# Altium project comunicador_alarma_v1.PrjPCB
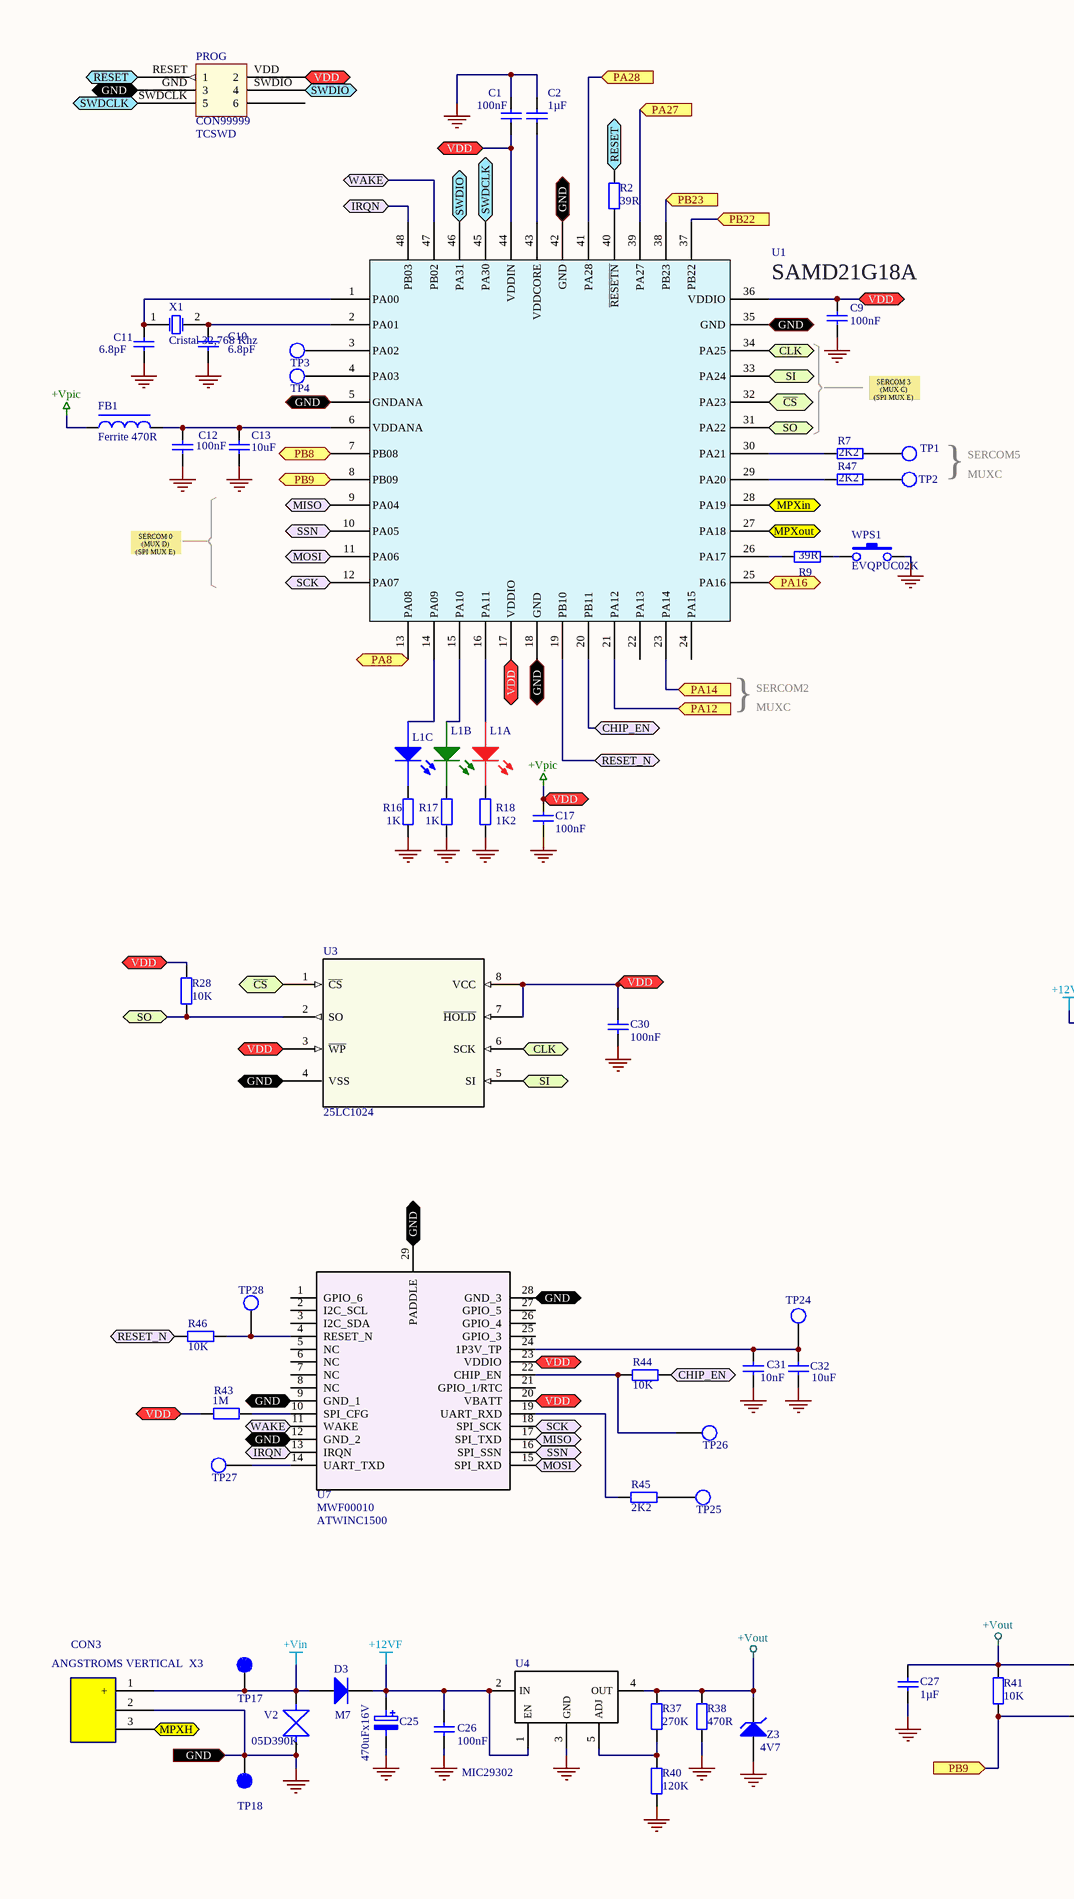
[diagram p0: comunicador_alarma_v1.SchDoc, left]
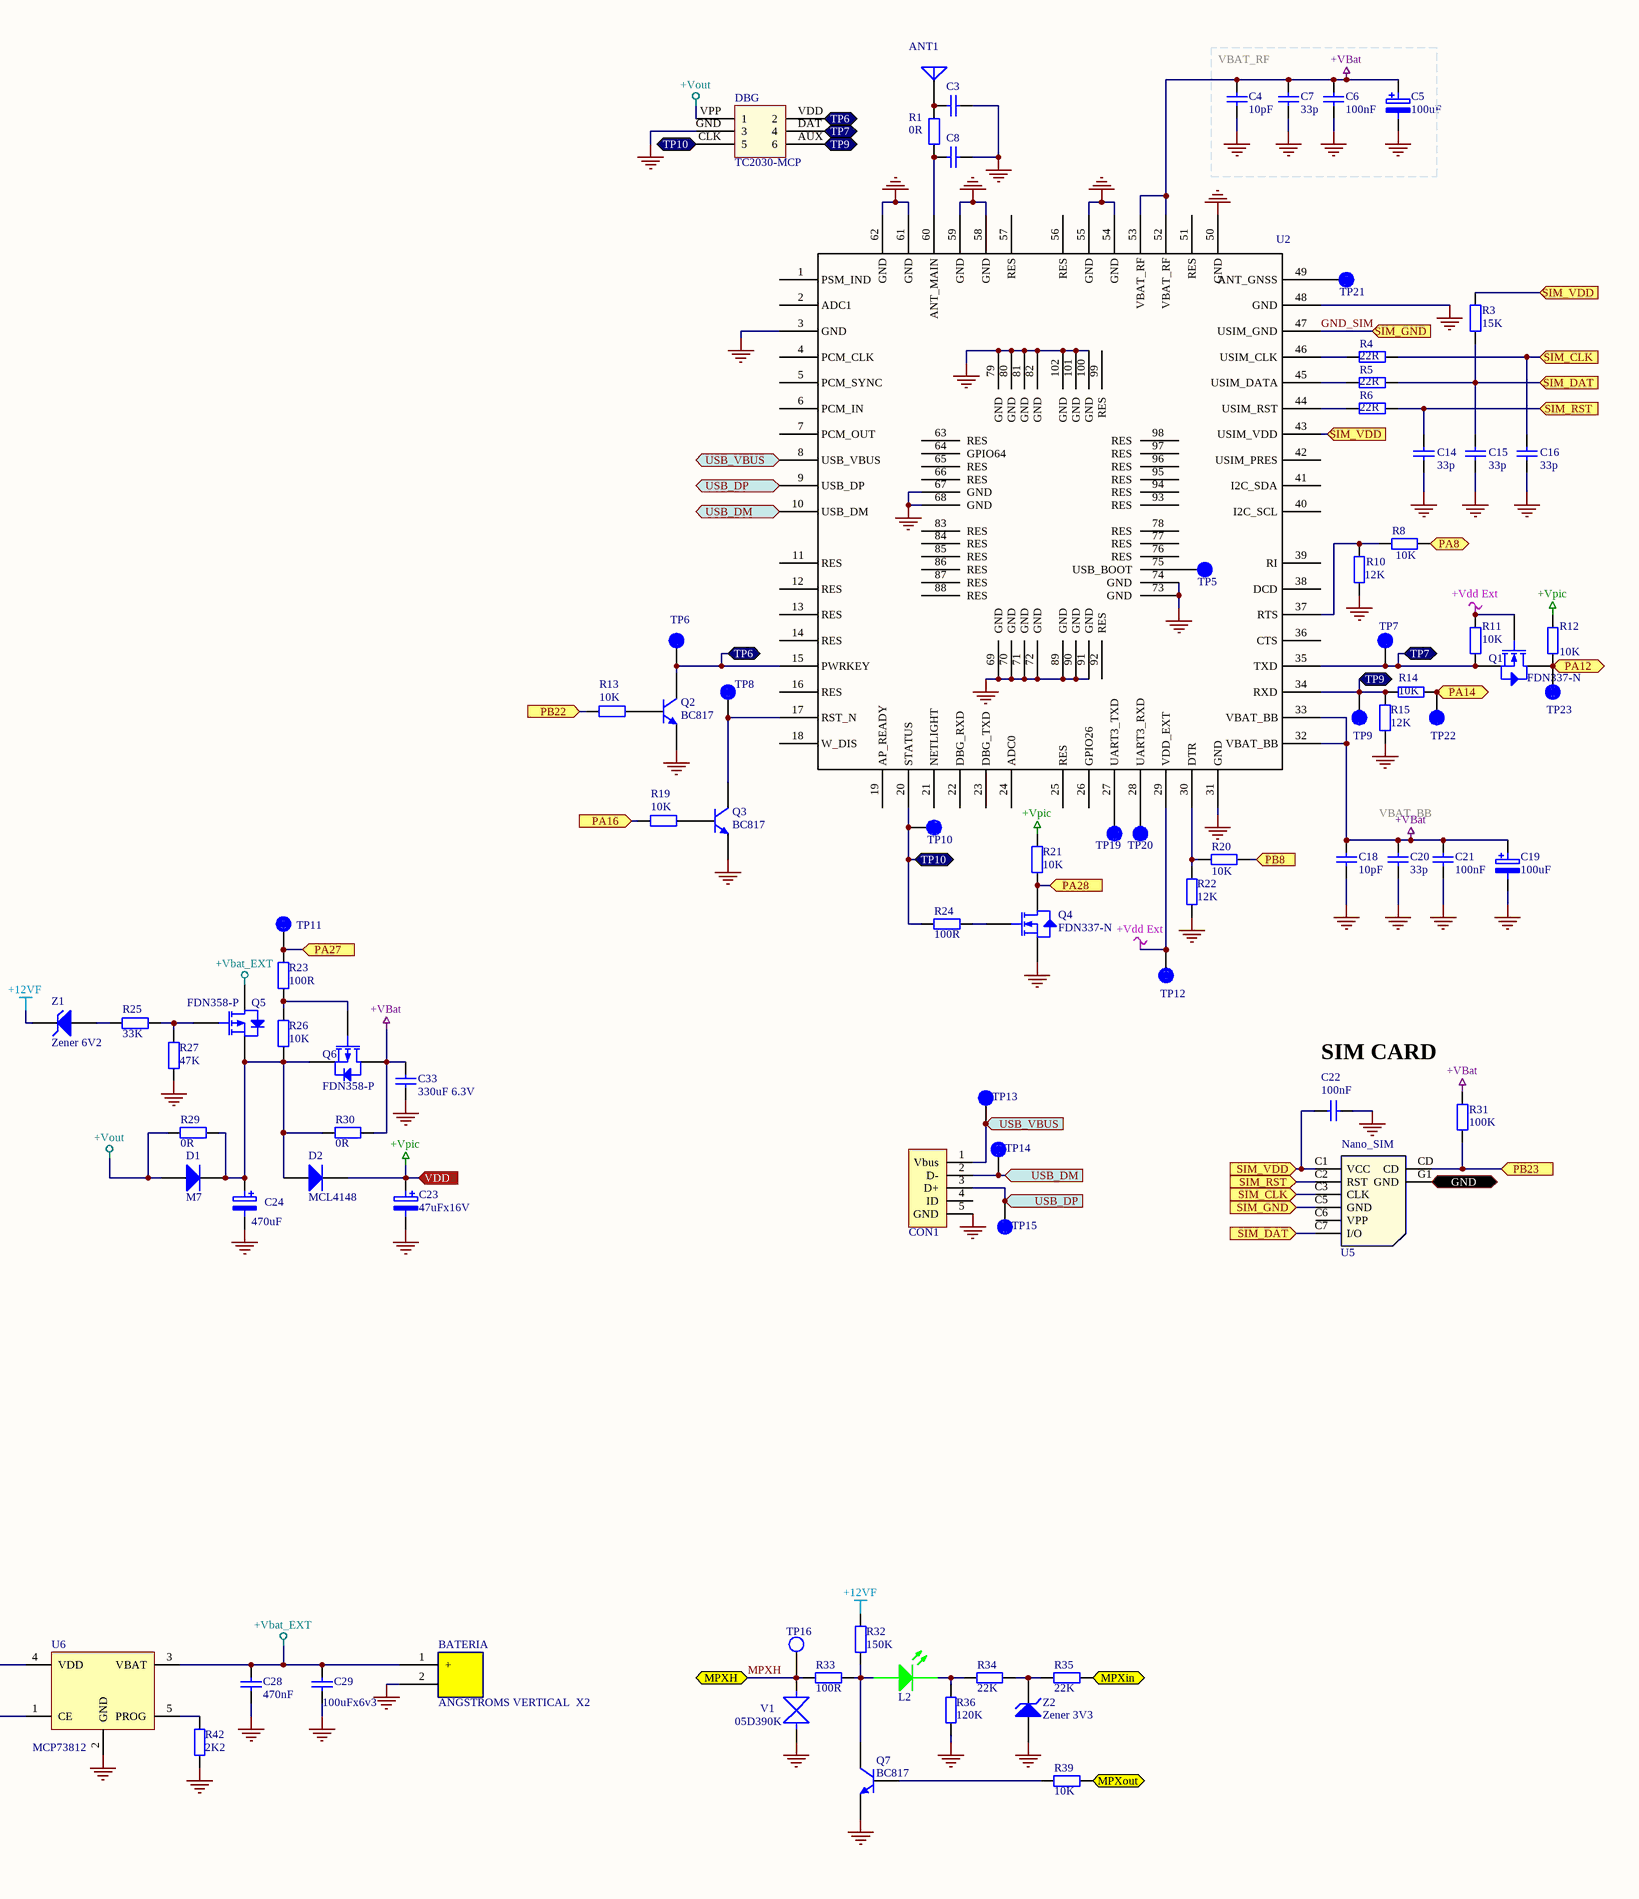
[diagram p1: comunicador_alarma_v1.SchDoc, right]
1 sheet, 141 parts. Net scope: flat (ports and power ports of the same name join across sheets).
Board file: comunicador_alarma_v1.PcbDoc

## Sheet comunicador_alarma_v1.SchDoc
size A2; DrawnBy: Mariano Mondani

### Parts
ANT1  CON01000  [CON.ANT]  (value not drawn)
BATERIA  value ANGSTROMS VERTICAL  X2  [CON.2V.SMD.ANGSTROMS]  (hidden comment: CON00590)
C1  value 100nF  [C.0805-rflow]  (hidden comment: CAX00450)
C2  value 1µF  [C.0805-rflow]  (hidden comment: CAX00500)
C3  (no value)  [C.0805-rflow]
C4  value 10pF  [C.0805-rflow]  (hidden comment: CAX00130)
C5  value 100uF  [CAP.TANT.3216-18]  (hidden comment: CTS00100)
C6  value 100nF  [C.0805-rflow]  (hidden comment: CAX00450)
C7  value 33p  [C.0805-rflow]  (hidden comment: CAX00180)
C8  (no value)  [C.0805-rflow]
C9  value 100nF  [C.0805-rflow]  (hidden comment: CAX00450)
C10  value 6.8pF  [C.0805-rflow]  (hidden comment: CAX00110)
C11  value 6.8pF  [C.0805-rflow]  (hidden comment: CAX00110)
C12  value 100nF  [C.0805-rflow]  (hidden comment: CAX00450)
C13  value 10uF  [C.212]  (hidden comment: CAX00520)
C14  value 33p  [C.0805-rflow]  (hidden comment: CAX00180)
C15  value 33p  [C.0805-rflow]  (hidden comment: CAX00180)
C16  value 33p  [C.0805-rflow]  (hidden comment: CAX00180)
C17  value 100nF  [C.0805-rflow]  (hidden comment: CAX00450)
C18  value 10pF  [C.0805-rflow]  (hidden comment: CAX00130)
C19  value 100uF  [CAP.TANT.3216-18]  (hidden comment: CTS00100)
C20  value 33p  [C.0805-rflow]  (hidden comment: CAX00180)
C21  value 100nF  [C.0805-rflow]  (hidden comment: CAX00450)
C22  value 100nF  [C.0805-rflow]  (hidden comment: CAX00450)
C23  value 47uFx16V  [CAP.CASE-C]  (hidden comment: CES00005)
C24  value 470uF  [CAP.CASE-E]  (hidden comment: CES00020)
C25  value 470uFx16V  [CAP.CASE-E]  (hidden comment: CES00020)
C26  value 100nF  [C.0805-rflow]  (hidden comment: CAX00450)
C27  value 1µF  [C.0805]  (hidden comment: CAX00500)
C28  value 470nF  [C.0805]  (hidden comment: CAX00460)
C29  value 100uFx6v3  [C.1206-rflow]  (hidden comment: CES00011)
C30  value 100nF  [C.0805-rflow]  (hidden comment: CAX00450)
C31  value 10nF  [C.0805-rflow]  (hidden comment: CAX00370)
C32  value 10uF  [C.212]  (hidden comment: CAX00520)
C33  value 330uF 6.3V  [C.1210]  (hidden comment: CAX00800)
CON1  USB MINI B Vert.  [USB.MINI.V]  (value not drawn)
CON3  value ANGSTROMS VERTICAL  X3  [CON.3V.SMD.ANGSTROMS]  (hidden comment: CON00600)
D1  value M7  [SMA.WAVE]  (hidden comment: DIS00030)
D2  value MCL4148  [MICROMELF-rflow]  (hidden comment: DIX00010)
D3  value M7  [SMA.RFLOW]  (hidden comment: DIS00030)
DBG  value TC2030-MCP  [TC.2030-IDC]  (hidden comment: CON99999)
FB1  value Ferrite 470R  [BOB.0603]  (hidden comment: FER00010)
L1  LES00150  [LED5050.RGB.FORYARD]  (value not drawn)  (parts A,B,C of 3)
L2  LES00090  [L.0805G]  (value not drawn)
PROG  value TCSWD  [TC_SWD]  (hidden comment: CON99999)
Q1  value FDN337-N  [SOT23-3]  (hidden comment: TRS00077)
Q2  value BC817  [SOT23-3]  (hidden comment: TRS00020)
Q3  value BC817  [SOT23-3]  (hidden comment: TRS00020)
Q4  value FDN337-N  [SOT23-3]  (hidden comment: TRS00077)
Q5  value FDN358-P  [SOT23-3]  (hidden comment: TRS00080)
Q6  value FDN358-P  [SOT23-3]  (hidden comment: TRS00080)
Q7  value BC817  [SOT23-3]  (hidden comment: TRS00020)
R1  value 0R  [R.0805-rflow]  (hidden comment: RSX00010)
R2  value 39R  [R.0805-rflow]  (hidden comment: RSX00065)
R3  value 15K  [R.0805-rflow]  (hidden comment: RSX00290)
R4  value 22R  [R.0805-rflow]  (hidden comment: RSX00050)
R5  value 22R  [R.0805-rflow]  (hidden comment: RSX00050)
R6  value 22R  [R.0805-rflow]  (hidden comment: RSX00050)
R7  value 2K2  [R.0805-rflow]  (hidden comment: RSX00200)
R8  value 10K  [R.0805-rflow]  (hidden comment: RSX00280)
R9  value 39R  [R.0805-rflow]  (hidden comment: RSX00065)
R10  value 12K  [R.0805-rflow]  (hidden comment: RSX00285)
R11  value 10K  [R.0805-rflow]  (hidden comment: RSX00280)
R12  value 10K  [R.0805-rflow]  (hidden comment: RSX00280)
R13  value 10K  [R.0805-rflow]  (hidden comment: RSX00280)
R14  value 10K  [R.0805-rflow]  (hidden comment: RSX00280)
R15  value 12K  [R.0805-rflow]  (hidden comment: RSX00285)
R16  value 1K  [R.0805-rflow]  (hidden comment: RSX00170)
R17  value 1K  [R.0805-rflow]  (hidden comment: RSX00170)
R18  value 1K2  [R.0805-rflow]  (hidden comment: RSX00180)
R19  value 10K  [R.0805-rflow]  (hidden comment: RSX00280)
R20  value 10K  [R.0805-rflow]  (hidden comment: RSX00280)
R21  value 10K  [R.0805-rflow]  (hidden comment: RSX00280)
R22  value 12K  [R.0805-rflow]  (hidden comment: RSX00285)
R23  value 100R  [R.0805-rflow]  (hidden comment: RSX00090)
R24  value 100R  [R.0805-rflow]  (hidden comment: RSX00090)
R25  value 33K  [R.0805-rflow]  (hidden comment: RSX00330)
R26  value 10K  [R.0805-rflow]  (hidden comment: RSX00280)
R27  value 47K  [R.0805-rflow]  (hidden comment: RSX00340)
R28  value 10K  [R.0805-rflow]  (hidden comment: RSX00280)
R29  value 0R  [R.0805-rflow]  (hidden comment: RSX00010)
R30  value 0R  [R.0805-rflow]  (hidden comment: RSX00010)
R31  value 100K  [R.0805-rflow]  (hidden comment: RSX00370)
R32  value 150K  [R.0805-rflow]  (hidden comment: RSX00390)
R33  value 100R  [R.0805-rflow]  (hidden comment: RSX00090)
R34  value 22K  [R.0805-rflow]  (hidden comment: RSX00310)
R35  value 22K  [R.0805-rflow]  (hidden comment: RSX00310)
R36  value 120K  [R.0805-rflow]  (hidden comment: RSX00380)
R37  value 270K  [R.0805-rflow]  (hidden comment: RSX00420)
R38  value 470R  [R.0805-rflow]  (hidden comment: RSX00140)
R39  value 10K  [R.0805-rflow]  (hidden comment: RSX00280)
R40  value 120K  [R.0805-rflow]  (hidden comment: RSX00380)
R41  value 10K  [R.0805-rflow]  (hidden comment: RSX00280)
R42  value 2K2  [R.0805-rflow]  (hidden comment: RSX00200)
R43  value 1M  [R.0805-rflow]  (hidden comment: RSX00490)
R44  value 10K  [R.0805-rflow]  (hidden comment: RSX00280)
R45  value 2K2  [R.0805-rflow]  (hidden comment: RSX00200)
R46  value 10K  [R.0805-rflow]  (hidden comment: RSX00280)
R47  value 2K2  [R.0805-rflow]  (hidden comment: RSX00200)
TP1  Test Point  [TestPoint_2mm]  (value not drawn)
TP2  Test Point  [TestPoint_2mm]  (value not drawn)
TP3  Test Point  [TestPoint_2mm]  (value not drawn)
TP4  Test Point  [TestPoint_2mm]  (value not drawn)
TP5  Test Point  [TestPoint_2mm]  (value not drawn)
TP6  Test Point  [TestPoint_2mm]  (value not drawn)
TP7  Test Point  [TestPoint_2mm]  (value not drawn)
TP8  Test Point  [TestPoint_2mm]  (value not drawn)
TP9  Test Point  [TestPoint_2mm]  (value not drawn)
TP10  Test Point  [TestPoint_2mm]  (value not drawn)
TP11  Test Point  [TestPoint_2mm]  (value not drawn)
TP12  Test Point  [TestPoint_2mm]  (value not drawn)
TP13  Test Point  [TestPoint_2mm]  (value not drawn)
TP14  Test Point  [TestPoint_2mm]  (value not drawn)
TP15  Test Point  [TestPoint_2mm]  (value not drawn)
TP16  Test Point  [TestPoint_2mm]  (value not drawn)
TP17  Test Point  [TestPoint_2mm]  (value not drawn)
TP18  Test Point  [TestPoint_2mm]  (value not drawn)
TP19  Test Point  [TestPoint_1mm]  (value not drawn)
TP20  Test Point  [TestPoint_1mm]  (value not drawn)
TP21  Test Point  [TestPoint_1mm]  (value not drawn)
TP22  Test Point  [TestPoint_2mm]  (value not drawn)
TP23  Test Point  [TestPoint_2mm]  (value not drawn)
TP24  Test Point  [TestPoint_2mm]  (value not drawn)
TP25  Test Point  [TestPoint_2mm]  (value not drawn)
TP26  Test Point  [TestPoint_2mm]  (value not drawn)
TP27  Test Point  [TestPoint_2mm]  (value not drawn)
TP28  Test Point  [TestPoint_2mm]  (value not drawn)
U1  value SAMD21G18A  [TQFP_48]  (hidden comment: INS00250)
U2  MCG00050  [QUECTEL BG96]  (value not drawn)
U3  value 25LC1024  [SOIJ-8]  (hidden comment: INS00260)
U4  value MIC29302  [TO263-5]  (hidden comment: INS00240)
U5  CON01026  [SIM_CARD_NANO_8065]  (value not drawn)
U6  value MCP73812  [SOT23-5]  (hidden comment: INS00180)
U7  MWF00010  value ATWINC1500  [ATWINC1500]
V1  value 05D390K  [R.1206-rflow]  (hidden comment: VAR00080)
V2  value 05D390K  [R.1206-rflow]  (hidden comment: VAR00080)
WPS1  value EVQPUC02K  [PUL.EVQPUC]  (hidden comment: TOU00120)
X1  value Cristal 32,768 Khz  [XTAL_SMD_32768]  (hidden comment: CRS00040)
Z1  value Zener 6V2  [SOT23-3]  (hidden comment: ZES00020)
Z2  value Zener 3V3  [SOT23-3]  (hidden comment: ZES00005)
Z3  value 4V7  [SOT23-3]  (hidden comment: ZES00010)

### Blocks framed on the sheet
VBAT_RF: C4-C7

### Ports
CHIP_EN, CLK, GND (bidir), GND (in), IRQN, MISO, MOSI, MPXH, MPXH (in), MPXin, MPXout, PA8 (in), PA12 (in), PA14 (in), PA16 (in), PA27 (in), PA28 (in), PB8 (in), PB9 (in), PB22 (in), PB23 (in), RESET, RESET_N, SCK, SI, SIM_CLK (in), SIM_DAT (in), SIM_GND (in), SIM_RST (in), SIM_VDD (in), SO, SSN, SWDCLK, SWDIO, TP6, TP7, TP9, TP10, USB_DM (in), USB_DP (in), USB_VBUS (in), VDD (bidir), VDD (in), WAKE, ~{CS}

### Nets
+12VF: C25.1 C26.2 D3.2(K) R32.2 U4.1(EN) U4.2(IN) Z1.3(K)
+VBat: C4.2 C5.2 C6.2 C7.2 C18.2 C19.2 C20.2 C21.2 C33.2 Q6.3(D) R30.2 R31.2 U2.32(VBAT_BB) U2.33(VBAT_BB) U2.52(VBAT_RF) U2.53(VBAT_RF)
+Vbat_EXT: BATERIA.1(+) C28.2 C29.2 Q5.3(D) U6.3(VBAT)
+Vdd Ext: Q1.1(G) R11.2 TP12.0 U2.29(VDD_EXT)
+Vin: CON3.1(+) D3.1(A) TP17.0 V2.2
+Vout: C27.2 D1.1(A) DBG.VPP(1) R29.1 R37.2 R38.2 R41.2 U4.4(OUT) U6.4(VDD) Z3.3(K)
+Vpic: C1.2 C9.2 C17.2 C23.1 C30.2 D2.2(K) FB1.1 PROG.VDD(2) R12.2 R21.2 R28.2 R43.1 U1.17(VDDIO) U1.36(VDDIO) U1.44(VDDIN) U3.3(~{WP}) U3.7(~{HOLD}) U3.8(VCC) U7.20(VBATT) U7.23(VDDIO) ; port VDD
GND: BATERIA.2 C1.1 C2.1 C3.2 C4.1 C5.1 C6.1 C7.1 C8.2 C9.1 C10.1 C11.1 C12.1 C13.1 C14.1 C15.1 C16.1 C17.1 C18.1 C19.1 C20.1 C21.1 C22.1 C23.2 C24.2 C25.2 C26.1 C27.1 C28.1 C29.1 C30.1 C31.1 C32.1 C33.1 CON1.5(GND) CON3.0 CON3.2 DBG.GND(3) PROG.GND(3) Q2.2(E) Q3.2(E) Q4.2(S) Q7.2(E) R10.1 R15.1 R16.1 R17.1 R18.1 R22.1 R27.1 R36.1 R38.1 R40.1 R42.1 TP18.0 U1.5(GNDANA) U1.18(GND) U1.35(GND) U1.42(GND) U2.3(GND) U2.31(GND) U2.48(GND) U2.50(GND) U2.54(GND) U2.55(GND) U2.58(GND) U2.59(GND) U2.61(GND) U2.62(GND) U2.67(GND) U2.68(GND) U2.69(GND) U2.70(GND) U2.71(GND) U2.72(GND) U2.73(GND) U2.74(GND) U2.79(GND) U2.80(GND) U2.81(GND) U2.82(GND) U2.89(GND) U2.90(GND) U2.91(GND) U2.100(GND) U2.101(GND) U2.102(GND) U3.4(VSS) U4.3(GND) U5.G1(GND) U6.2(GND) U7.9(GND_1) U7.12(GND_2) U7.28(GND_3) U7.29(PADDLE) V1.1 V2.1 WPS1.2 Z2.1(A) Z3.1(A) ; port GND
GND_SIM: U2.47(USIM_GND) U5.C5(GND) ; port SIM_GND
MPXH: CON3.3 R33.1 TP16.0 V1.2 ; port MPXH
NetANT1_1: ANT1.1(A) C3.1 R1.2
NetC2_2: C2.2 U1.43(VDDCORE)
NetC8_1: C8.1 R1.1 U2.60(ANT_MAIN)
NetC10_2: C10.2 U1.2(PA01) X1.2(OSC2)
NetC11_2: C11.2 U1.1(PA00) X1.1(OSC1)
NetC12_2: C12.2 C13.2 FB1.2 U1.6(VDDANA)
NetC14_2: C14.2 R6.2 U5.C2(RST) ; port SIM_RST
NetC15_2: C15.2 R3.1 R5.2 U5.C7(I/O) ; port SIM_DAT
NetC16_2: C16.2 R4.2 U5.C3(CLK) ; port SIM_CLK
NetC22_2: C22.2 R3.2 U2.43(USIM_VDD) U5.C1(VCC) ; port SIM_VDD
NetC24_1: C24.1 D1.2(K) D2.1(A) Q5.2(S) Q6.2(S) R26.2 R29.2 R30.1
NetC31_2: C31.2 C32.2 TP24.0 U7.24(1P3V_TP)
NetCON1_1: CON1.1(Vbus) TP13.0 U2.8(USB_VBUS) ; port USB_VBUS
NetCON1_2: CON1.2(D-) TP14.0 U2.10(USB_DM) ; port USB_DM
NetCON1_3: CON1.3(D+) TP15.0 U2.9(USB_DP) ; port USB_DP
NetDBG_AUX: DBG.AUX(6) R14.1 R15.2 TP9.0 U2.34(RXD) ; port TP9
NetDBG_CLK: DBG.CLK(5) R24.1 TP10.0 U2.20(STATUS) ; port TP10
NetDBG_DAT: DBG.DAT(4) Q1.2(S) R11.1 TP7.0 U2.35(TXD) ; port TP7
NetDBG_VDD: DBG.VDD(2) Q2.3(C) TP6.0 U2.15(PWRKEY) ; port TP6
NetL1_AB: L1.AB U1.14(PA09)
NetL1_AG: L1.AG U1.15(PA10)
NetL1_AR: L1.AR U1.16(PA11)
NetL1_KB: L1.KB R16.2
NetL1_KG: L1.KG R17.2
NetL1_KR: L1.KR R18.2
NetL2_A: L2.A Q7.3(C) R32.1 R33.2
NetL2_K: L2.K R34.1 R36.2
NetPROG_RESET: PROG.RESET(1) R2.1 ; port RESET
NetPROG_SWDCLK: PROG.SWDCLK(5) U1.45(PA30) ; port SWDCLK
NetPROG_SWDIO: PROG.SWDIO(4) U1.46(PA31) ; port SWDIO
NetQ1_3: Q1.3(D) R12.1 TP23.0 U1.21(PA12) ; port PA12
NetQ2_1: Q2.1(B) R13.1
NetQ3_1: Q3.1(B) R19.1
NetQ3_3: Q3.3(C) TP8.0 U2.17(RST_N)
NetQ4_1: Q4.1(G) R24.2
NetQ4_3: Q4.3(D) R21.1 U1.41(PA28) ; port PA28
NetQ5_1: Q5.1(G) R25.2 R27.2
NetQ6_1: Q6.1(G) R23.1 R26.1
NetQ7_1: Q7.1(B) R39.1
NetR2_2: R2.2 U1.40(~{RESETN})
NetR4_1: R4.1 U2.46(USIM_CLK)
NetR5_1: R5.1 U2.45(USIM_DATA)
NetR6_1: R6.1 U2.44(USIM_RST)
NetR7_1: R7.1 U1.30(PA21)
NetR7_2: R7.2 TP1.0
NetR8_1: R8.1 U1.13(PA08) ; port PA8
NetR8_2: R8.2 R10.2 U2.37(RTS)
NetR9_1: R9.1 WPS1.1
NetR9_2: R9.2 U1.26(PA17)
NetR13_2: R13.2 U1.37(PB22) ; port PB22
NetR14_2: R14.2 TP22.0 U1.23(PA14) ; port PA14
NetR19_2: R19.2 U1.25(PA16) ; port PA16
NetR20_1: R20.1 R22.2 U2.30(DTR)
NetR20_2: R20.2 U1.7(PB08) ; port PB8
NetR23_2: R23.2 TP11.0 U1.39(PA27) ; port PA27
NetR25_1: R25.1 Z1.1(A)
NetR28_1: R28.1 U1.31(PA22) U3.2(SO) ; port SO
NetR31_1: R31.1 U1.38(PB23) U5.CD ; port PB23
NetR34_2: R34.2 R35.1 Z2.3(K)
NetR35_2: R35.2 U1.28(PA19) ; port MPXin
NetR37_1: R37.1 R40.2 U4.5(ADJ)
NetR39_2: R39.2 U1.27(PA18) ; port MPXout
NetR41_1: R41.1 U1.8(PB09) U6.1(CE) ; port PB9
NetR42_2: R42.2 U6.5(PROG)
NetR43_2: R43.2 U7.10(SPI_CFG)
NetR44_1: R44.1 TP26.0 U7.22(CHIP_EN)
NetR44_2: R44.2 U1.20(PB11) ; port CHIP_EN
NetR45_1: R45.1 U7.19(UART_RXD)
NetR45_2: R45.2 TP25.0
NetR46_1: R46.1 U1.19(PB10) ; port RESET_N
NetR46_2: R46.2 TP28.0 U7.4(RESET_N)
NetR47_1: R47.1 U1.29(PA20)
NetR47_2: R47.2 TP2.0
NetTP3_0: TP3.0 U1.3(PA02)
NetTP4_0: TP4.0 U1.4(PA03)
NetTP5_0: TP5.0 U2.75(USB_BOOT)
NetTP19_0: TP19.0 U2.27(UART3_TXD)
NetTP20_0: TP20.0 U2.28(UART3_RXD)
NetTP21_0: TP21.0 U2.49(ANT_GNSS)
NetTP27_0: TP27.0 U7.14(UART_TXD)
NetU1_9: U1.9(PA04) U7.17(SPI_TXD) ; port MISO
NetU1_10: U1.10(PA05) U7.16(SPI_SSN) ; port SSN
NetU1_11: U1.11(PA06) U7.15(SPI_RXD) ; port MOSI
NetU1_12: U1.12(PA07) U7.18(SPI_SCK) ; port SCK
NetU1_32: U1.32(PA23) U3.1(~{CS}) ; port ~{CS}
NetU1_33: U1.33(PA24) U3.5(SI) ; port SI
NetU1_34: U1.34(PA25) U3.6(SCK) ; port CLK
NetU1_47: U1.47(PB02) U7.11(WAKE) ; port WAKE
NetU1_48: U1.48(PB03) U7.13(IRQN) ; port IRQN

Not connected (* = marked no-connect by the designer): CON1 4(ID); PROG ?1(6); U1 22(PA13) 24(PA15); U2 1(PSM_IND) 2(ADC1) 4(PCM_CLK) 5(PCM_SYNC) 6(PCM_IN) 7(PCM_OUT) 11(RES) 12(RES) 13(RES) 14(RES) 16(RES) 18(W_DIS) 19(AP_READY) 21(NETLIGHT) 22(DBG_RXD) 23(DBG_TXD) 24(ADC0) 25(RES) 26(GPIO26) 36(CTS) 38(DCD) 39(RI) 40(I2C_SCL) 41(I2C_SDA) 42(USIM_PRES) 51(RES) 56(RES) 57(RES) 63(RES) 64(GPIO64) 65(RES) 66(RES) 76(RES) 77(RES) 78(RES) 83(RES) 84(RES) 85(RES) 86(RES) 87(RES) 88(RES) 92(RES) 93(RES) 94(RES) 95(RES) 96(RES) 97(RES) 98(RES) 99(RES); U5 C6(VPP); U7 1(GPIO_6) 2(I2C_SCL) 3(I2C_SDA) 5(NC) 6(NC) 7(NC) 8(NC) 21(GPIO_1/RTC) 25(GPIO_3) 26(GPIO_4) 27(GPIO_5)

### Notes on the sheet
- SERCOM 3
  (MUX C)
  (SPI MUX E)
- }
- SERCOM5
- MUXC
- SERCOM 0
  (MUX D)
  (SPI MUX E)
- SERCOM2
- (near U1) }
- VBAT_BB
- SIM CARD
- (in symbol Sim.Card.Nano_8065) Nano_SIM

### Library data of the parts
ANT1 = ANT.GSM2: Antenna GSM; MFG: CON01000; Value: Antenna GSM
BATERIA = CON.2.SMD.VER: Conector Angstroms 2V; Part Number: A2001WV-S-2P; Manufacturer: ANGSTROMS CORP.; MFG: CON00590
C1 C6 C9 C12 C17 C21 C22 C26 C30 = CAP.100n: Capacitor SMD; MFG: CAX00450
C2 C27 = CAP.1u: Capacitor SMD; MFG: CAX00500
C3 C7 C8 C14-C16 C20 = CAP.33p: Capacitor SMD
  C3 C8: Value: ?
  C7 C14-C16 C20: MFG: CAX00180
C4 C18 = CAP.10p: Capacitor SMD; MFG: CAX00130
C5 C19 = CAP.100uFTant: Capacitor Tantalio; Part Number: F930J107KAA; Manufacturer: AVX Corporation; MFG: CTS00100
C10 C11 = CAP.6.8pF: Capacitor SMD; MFG: CAX00110
C13 C32 = CAP.10uF: Capacitor 212; Part Number: EMK212BJ106MG-T; Supplier: Taiyo; MFG: CAX00520
C23 = CAP.47µ-A: Capacitor Aluminio SMD; Part Number: ELV470M16RC; Supplier: Hitano; MFG: CES00005
C24 C25 = CAP.470µ-A: Capacitor Aluminio SMD; Part Number: ELV471M16RE; Supplier: Hitano; MFG: CES00020
C28 = CAP.470n: Capacitor SMD; MFG: CAX00460
C29 = CAP.100µ-S: Capacitor 1206 SMD; Part Number: JMK316BJ107ML-T; Manufacturer: Taiyo Yuden; Supplier: Digi-Key; MFG: CES00011
C31 = CAP.10n: Capacitor SMD; MFG: CAX00370
C33 = CAP.330u: Capacitor SMD; Part Number: 1210X337M063N; Manufacturer: Hitano; MFG: CAX00800
CON1 = USB MINI Vert.: Part Number: MUSB-B5-S-VT-02; Manufacturer: Adam Tech.; Value: Mini USB Vert.
CON3 = CON.3.SMD.VER: Conector Angstroms 3V; Part Number: A2001WV-S-3P; Manufacturer: ANGSTROMS CORP.; MFG: CON00600
D1 D3 = DIO.M7: Diodo DSMA; Manufacturer: Shenzhen Luguang Electronic Technology; Part Number: M7; Supplier: Classic Component; MFG: DIS00030
D2 = DIO.4148mM: Diodo microMELF; Part Number: MCL4148-TR; Manufacturer: VISHAY; Supplier: Classic Component; MFG: DIX00010
DBG = TC2030-MCP_AUX: Conector Grabación; MFG: CON99999
FB1 = FER.470R: Ferrite 470; Part Number: BLM18PG471SN1D; Manufacturer: Murata Electronics; MFG: FER00010
L1 = LED.RGB.5050 FORYARD: Led RGB 5050; Part Number: FYLS-5050 RGBC; Value: Led RGB 5050 FY; Manufacturer: FORYARD; Datasheet: http://www.foryard.com/x-en/p-download/d-Part/u-f/m-1/n-f_FYLS-5050RGBC/y-394; MFG: LES00150
L2 = L.0805G: Led 0805; Part Number: TY-0805 YG1; Value: Led 0805 Verde; MFG: LES00090
PROG = TCSWD: Conector Grabación; MFG: CON99999
Q1 Q4 = Q.337N: N-Channel MOSFET; Part Number: FDN337N; Manufacturer: On Semiconductor; MFG: TRS00077
Q2 Q3 Q7 = Q.817: NPN-TBJ; Part Number: BC817-25LT1G; Manufacturer: ON-SEMI; Supplier: Arrow Electronics; MFG: TRS00020
Q5 Q6 = Q.358p: P-Channel MOSFET; Part Number: FDN358P; Manufacturer: Fairchld; Supplier: Arrow Electronics; Supplier 2: Classic Component; MFG: TRS00080
R1 R30 = RES.0R: MFG: RSX00010
R2 R9 = RES.39R: MFG: RSX00065
R3 = RES.15K: MFG: RSX00290
R4-R6 = RES.22R: MFG: RSX00050
R7 R45 R47 = RES.2K2: MFG: RSX00200
R8 R11-R14 R19-R21 R26 R28 R39 R44 = RES.10K: MFG: RSX00280
R10 R15 R22 = RES.12K: MFG: RSX00285
R16 R17 = RES.1K: MFG: RSX00170
R18 = RES.1K2: MFG: RSX00180
R23 R33 = RES.100R: MFG: RSX00090
R24 = RES.100r: MFG: RSX00090
R25 = RES.33K: MFG: RSX00330
R27 = RES.47k: MFG: RSX00340
R29 = RES.0r: MFG: RSX00010
R31 = RES.100K: MFG: RSX00370
R32 = RES.150K: MFG: RSX00390
R34 R35 = RES.22K: MFG: RSX00310
R36 R40 = RES.120K: MFG: RSX00380
R37 = RES.270K: MFG: RSX00420
R38 = RES.470R: MFG: RSX00140
R41 R46 = RES.10k: MFG: RSX00280
R42 = RES.2k2: MFG: RSX00200
R43 = RES.1M: MFG: RSX00490
U1 = SAM D21G18A: SMART ARM-Based Microcontroller; Part Number: ATSAMD21G18A; Manufacturer: Atmel; MFG: INS00250
U2 = QUECTEL BG96: GSM BG96; Part Number: BG96; Manufacturer: Quectel; MFG: MCG00050
U3 = 25LC1024_SOIJ: SPI EEPROM; Manufacturer: Microchip; Part Number: 25LC1024; MFG: INS00260
U4 = MIC29302: Regulador Seteable 3A; MFG: INS00240
U5 = Sim.Card.Nano_8065: Sim.Card.Nano_SIM8065 c/retención; Manufacturer: GCT; Part Number: SIM8065; MFG: CON01026
U6 = MCP73812: Regulador; Part Number: MCP73812T-420I/OT; Manufacturer: Microchip; Supplier: Classic Component; Part Number 2: MCP73812T-420I/OT; Manufacturer 2: Microchip; Supplier 2: Ibars Electronics; MFG: INS00180
U7 = ATWINC1500-MR210PB: Módulo WIFI; Manufacturer: Microchip; MFG: MWF00010; Part Number: ATWINC1500-MR210PB
V1 V2 = VAR.05SMD: Varistor SMD 39V; MFG: VAR00080
WPS1 = PUL.EVQ: Tecla 90° SMD; Manufacturer: Panasonic Electronic Components; Part Number: EVQPUC02K; MFG: TOU00120
X1 = X.32,768K: Cristal 32,768 Khz; Part Number: ST3215SB32768C0HPWBB; Manufacturer: Kyocera International Inc.; MFG: CRS00040
Z1 = Z.6V2: Zenner SMD; MFG: ZES00020
Z2 = Z.3V3: Zenner SMD; Part Number: BZX84-C3V3; Manufacturer: NXP SEMICONDUCTOR; Supplier: Classic Component; MFG: ZES00005
Z3 = Z.4V7: Zenner SMD; Part Number: BZX84-C4V7,215; Manufacturer: NXP SEMICONDUCTOR; Supplier: Classic Component; Supplier 2: Arrow Electronics; MFG: ZES00010